# Altium schematic sheet SPIDER_ROBOT_1.SchDoc
size A4; SheetNumber: 1; SheetTotal: 1
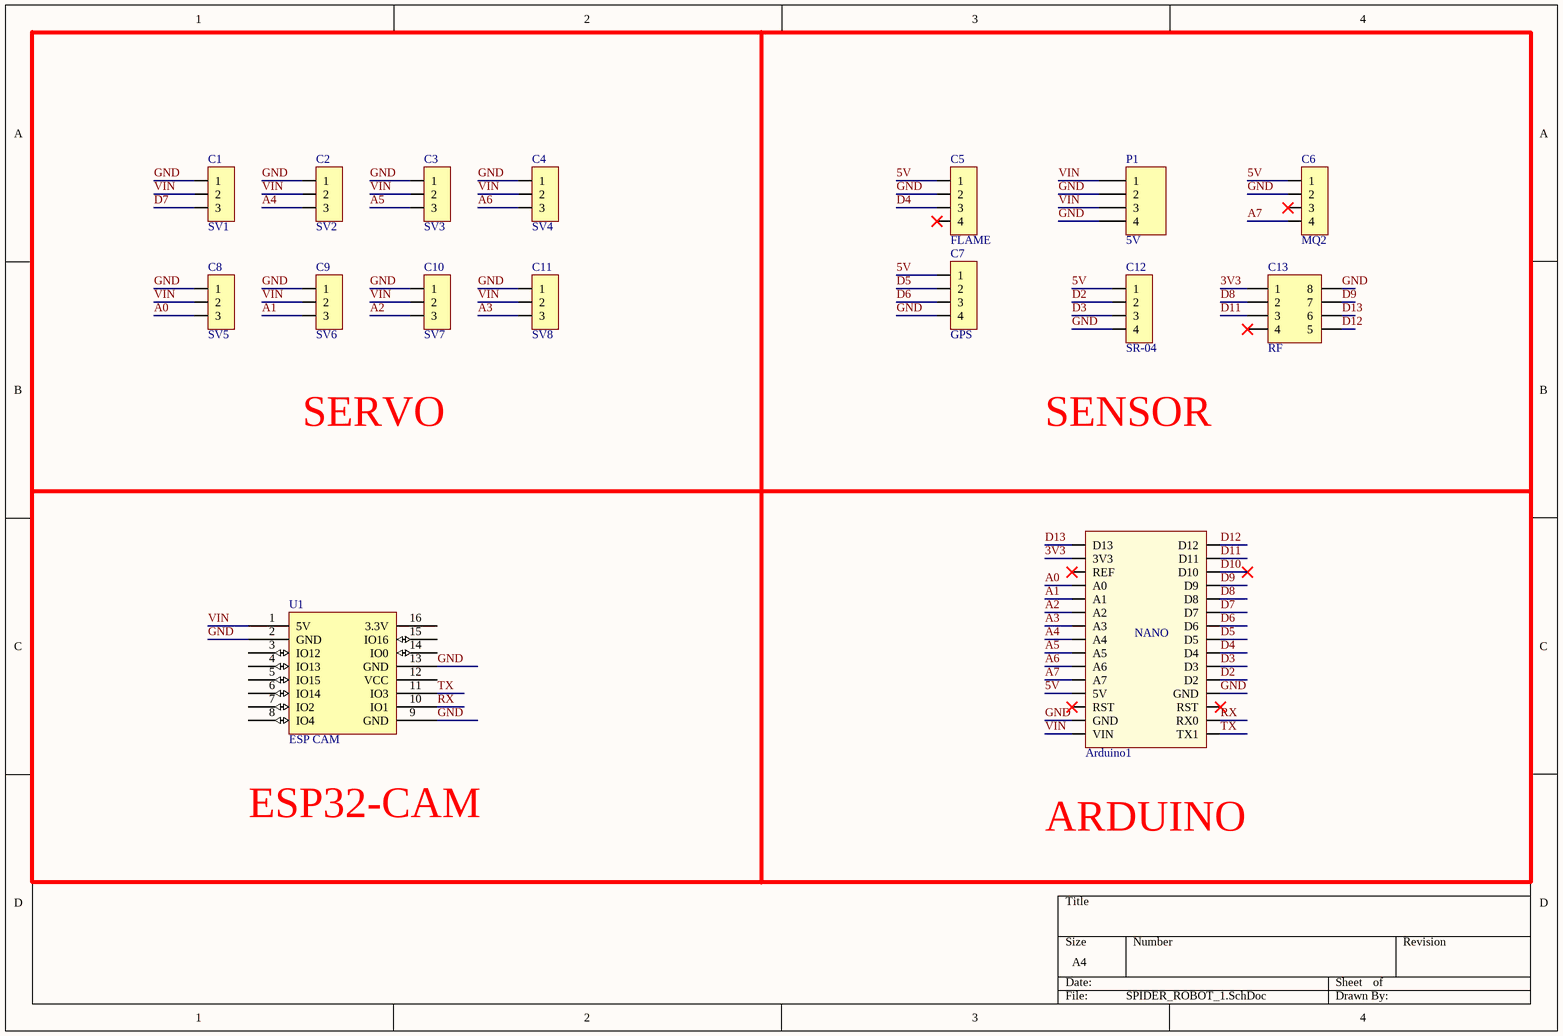
[diagram p0: SPIDER_ROBOT_1.SchDoc]

## Parts
Arduino1  Arduino Nano  [Arduino Nano]  (value not drawn)
C1  SV1  [JP3-D1T]
C2  SV2  [JP3-D1T]
C3  SV3  [JP3-D1T]
C4  SV4  [JP3-D1T]
C5  FLAME  [JP4-C1T]
C6  MQ2  [JP4-C1T]
C7  GPS  [JP4-C1T]
C8  SV5  [JP3-D1T]
C9  SV6  [JP3-D1T]
C10  SV7  [JP3-D1T]
C11  SV8  [JP3-D1T]
C12  SR-04  [JP4-C1T]
C13  RF  [JP4-C2T]
P1  5V  [DOMINO_4P_2.54MM]
U1  ESP CAM  [ESP32_CAM]

## Nets
3V3: Arduino1.3V3 C13.1
5V: Arduino1.5V C5.1 C6.1 C7.1 C12.1
A0: Arduino1.A0 C8.3
A1: Arduino1.A1 C9.3
A2: Arduino1.A2 C10.3
A3: Arduino1.A3 C11.3
A4: Arduino1.A4 C2.3
A5: Arduino1.A5 C3.3
A6: Arduino1.A6 C4.3
A7: Arduino1.A7 C6.4
D2: Arduino1.D2 C12.2
D3: Arduino1.D3 C12.3
D4: Arduino1.D4 C5.3
D5: Arduino1.D5 C7.2
D6: Arduino1.D6 C7.3
D7: Arduino1.D7 C1.3
D8: Arduino1.D8 C13.2
D9: Arduino1.D9 C13.7
D10: Arduino1.D10
D11: Arduino1.D11 C13.3
D12: Arduino1.D12 C13.5
D13: Arduino1.D13 C13.6
GND: Arduino1.GND C1.1 C2.1 C3.1 C4.1 C5.2 C6.2 C7.4 C8.1 C9.1 C10.1 C11.1 C12.4 C13.8 P1.2 P1.4 U1.2(GND) U1.9(GND) U1.13(GND)
RX: Arduino1.RX0 U1.10(IO1)
TX: Arduino1.TX1 U1.11(IO3)
VIN: Arduino1.VIN C1.2 C2.2 C3.2 C4.2 C8.2 C9.2 C10.2 C11.2 P1.1 P1.3 U1.1(5V)

Not connected (* = marked no-connect by the designer): Arduino1 REF* RST*; C5 4*; C6 3*; C13 4*; U1 3(IO12) 4(IO13) 5(IO15) 6(IO14) 7(IO2) 8(IO4) 12(VCC) 14(IO0) 15(IO16) 16(3.3V)

## Notes on the sheet
- SERVO
- SENSOR
- ESP32-CAM
- ARDUINO
- (in symbol Arduino Nano) NANO

## Library data of the parts
Arduino1 = Arduino Nano: Value: Cau 1A
C1-C4 C8-C11 = JP3: WR-PHD 2.54 mm Angled Socket Header; Manufacturer: W¨¹rth Elektronik eiSos GmbH; partNo: 613003143121; ComponentLink1 Description: Manufacturer; ComponentLink2 Description: Datasheet; NoPins: 03; Created Date: 29 March 2013; ComponentLink1URL: http://www.we-online.com; ComponentLink2URL: http://katalog.we-online.de/em/datasheet/6130xx143121.pdf; Created by: Karrer Zheng
C5-C7 C12 = JP4: WR-PHD 2.54 mm Angled Socket Header; Manufacturer: W¨¹rth Elektronik eiSos GmbH; partNo: 613004143121; ComponentLink1 Description: Manufacturer; ComponentLink2 Description: Datasheet; NoPins: 04; Created Date: 29 March 2013; ComponentLink1URL: http://www.we-online.com; ComponentLink2URL: http://katalog.we-online.de/em/datasheet/6130xx143121.pdf; Created by: Karrer Zheng
C13 = JP4x2: WR-PHD 2.54 mm Dual Socket Header; Manufacturer: W¨¹rth Elektronik eiSos GmbH; partNo: 61300821821; ComponentLink1 Description: Manufacturer; ComponentLink2 Description: Datasheet; NoPins: 08; Created Date: 29 March 2013; ComponentLink1URL: http://www.we-online.com; ComponentLink2URL: http://katalog.we-online.de/em/datasheet/6130xx21821.pdf; Created by: Karrer Zheng
P1 = Domino 4 pin
U1 = ESP32_CAM: ESP-12 Wi-Fi Module by AI-Thinker; IC: ESP8266-EX; Vendor: Ai-thinker